# EAGLE design fpc_cable_all (EAGLE 9.6.2)
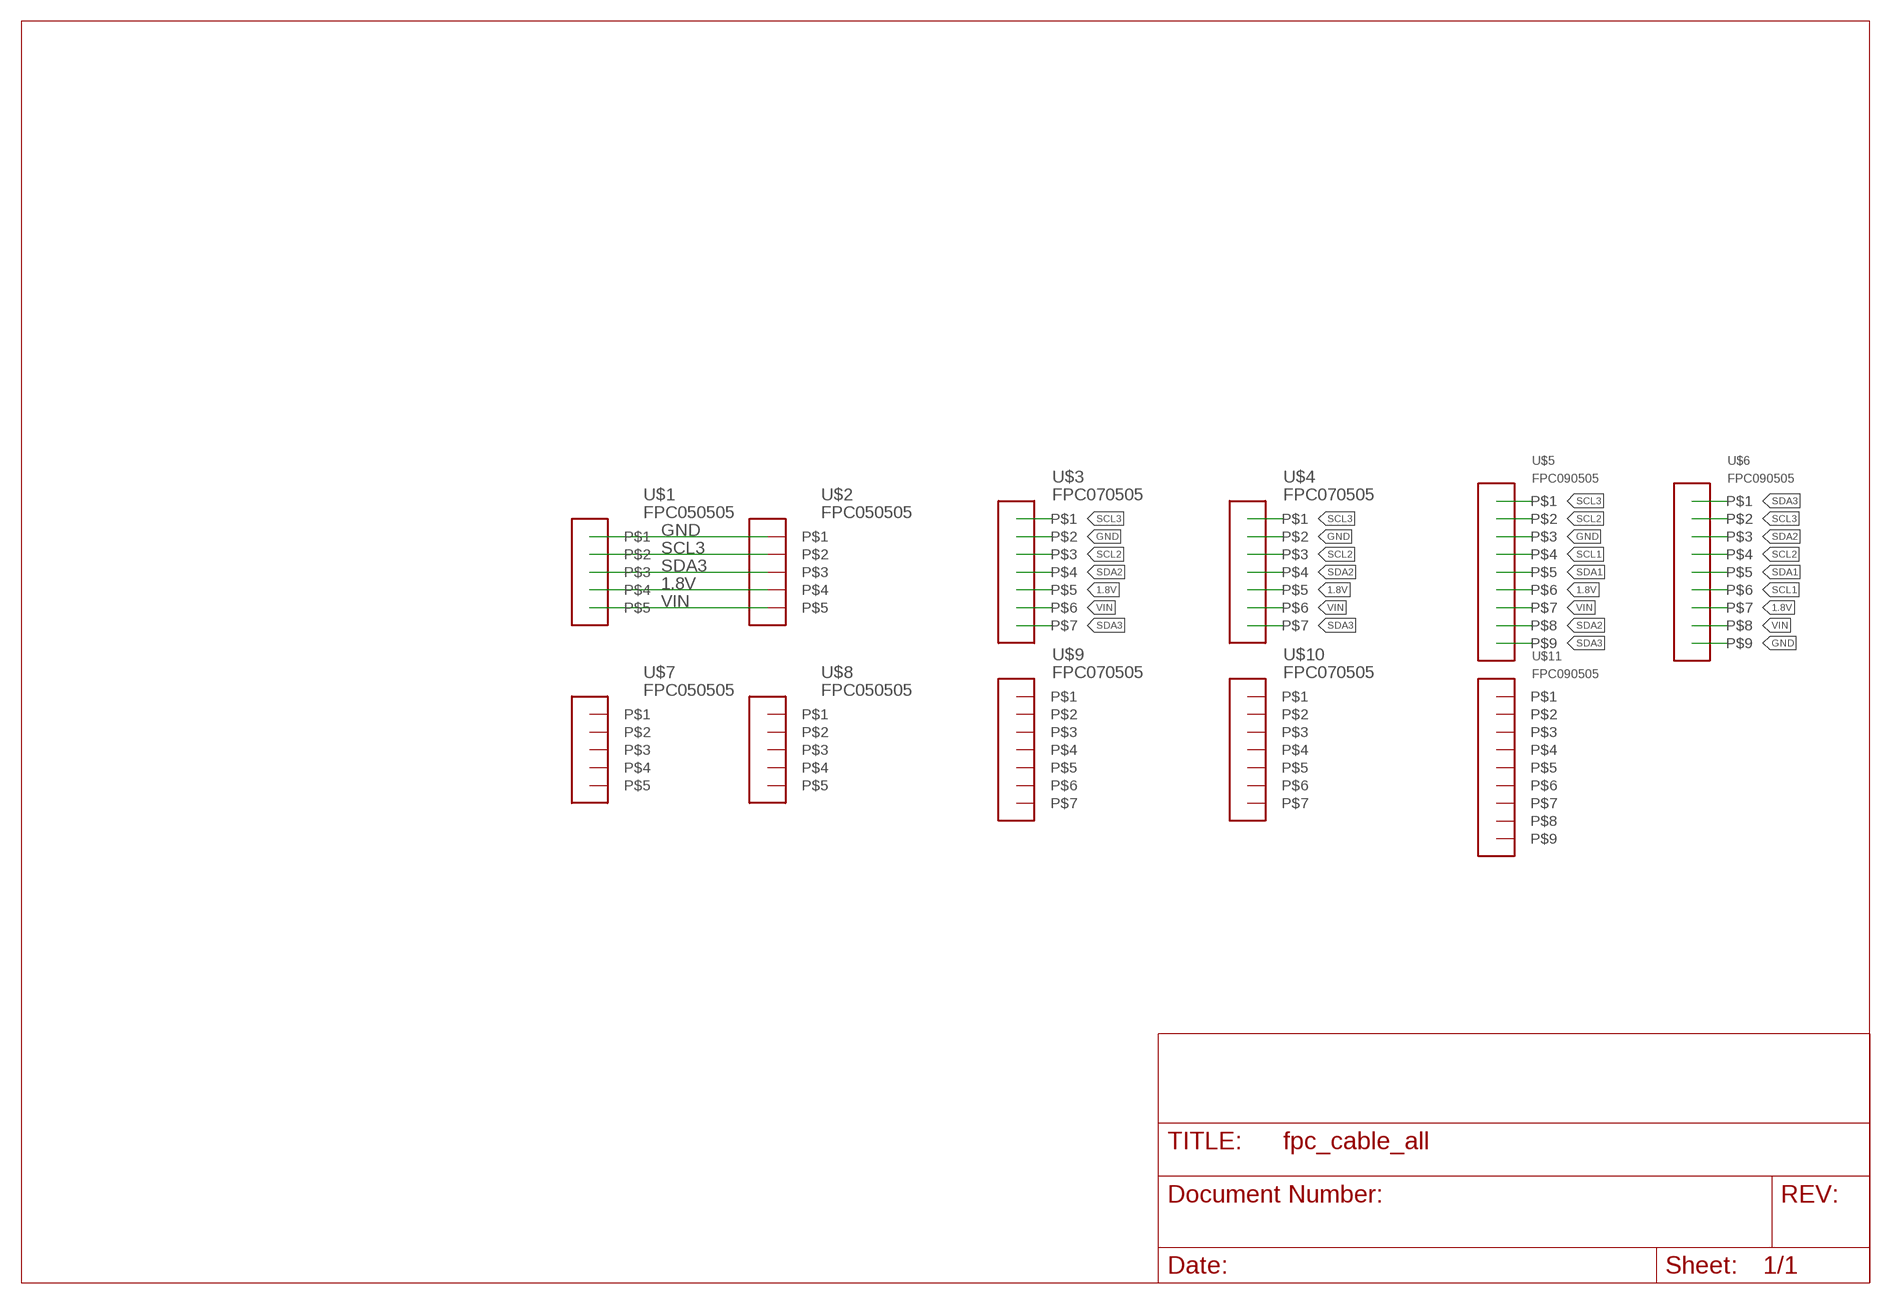
[diagram p0: schematic, sheet 1]

## Parts
U$1  FPC050505  [FPC0505]
U$2  FPC050505  [FPC0505]
U$3  FPC070505  [FPC0705]
U$4  FPC070505  [FPC0705]
U$5  FPC090505  [FPC0905]
U$6  FPC090505  [FPC0905]
U$7  FPC050505  [FPC0505]
U$8  FPC050505  [FPC0505]
U$9  FPC070505  [FPC0705]
U$10  FPC070505  [FPC0705]
U$11  FPC090505  [FPC0905]

## Nets
1.8V: U$1.P$4 U$2.P$4 U$3.P$5 U$4.P$5 U$5.P$6 U$6.P$7
GND: U$1.P$1 U$2.P$1 U$3.P$2 U$4.P$2 U$5.P$3 U$6.P$9
SCL1: U$5.P$4 U$6.P$6
SCL2: U$3.P$3 U$4.P$3 U$5.P$2 U$6.P$4
SCL3: U$1.P$2 U$2.P$2 U$3.P$1 U$4.P$1 U$5.P$1 U$6.P$2
SDA1: U$5.P$5 U$6.P$5
SDA2: U$3.P$4 U$4.P$4 U$5.P$8 U$6.P$3
SDA3: U$1.P$3 U$2.P$3 U$3.P$7 U$4.P$7 U$5.P$9 U$6.P$1
VIN: U$1.P$5 U$2.P$5 U$3.P$6 U$4.P$6 U$5.P$7 U$6.P$8
Unconnected: U$7.P$1 U$7.P$2 U$7.P$3 U$7.P$4 U$7.P$5 U$8.P$1 U$8.P$2 U$8.P$3 U$8.P$4 U$8.P$5 U$9.P$1 U$9.P$2 U$9.P$3 U$9.P$4 U$9.P$5 U$9.P$6 U$9.P$7 U$10.P$1 U$10.P$2 U$10.P$3 U$10.P$4 U$10.P$5 U$10.P$6 U$10.P$7 U$11.P$1 U$11.P$2 U$11.P$3 U$11.P$4 U$11.P$5 U$11.P$6 U$11.P$7 U$11.P$8 U$11.P$9

## Library data of the parts
U$1 U$2 U$7 U$8 = my_library:FPC0505
U$3 U$4 U$9 U$10 = my_library:FPC0705
U$5 U$6 U$11 = my_library:FPC0905

## Board
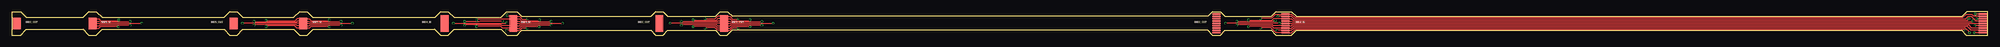
[diagram p1: board, top side]
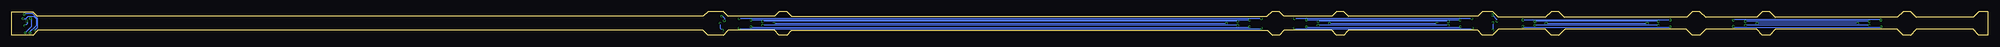
[diagram p2: board, bottom side, seen from below]

Size 422.3 x 5 mm. Coordinates in mm from the lower left corner, seen from the top.
Outline: 417.7,0 422.3,0 422.3,5 417.8,5 416.8,4 274.5,4 273.5,5 270.2,5 269.2,4 259.3,4 258.3,5 256.6,5 255.6,4 154,4 153,5 151.4,5 150.4,4 140.2,4 139.2,5 137.6,5 136.6,4 109,4 108,5 105.8,5 104.6,3.8 94.5,3.8 93.3,5 91.7,5 90.5,3.8 64.3,3.8 63.1,5 61.5,5 60.3,3.8 49.4,3.8 48.2,5 46.6,5 45.4,3.8 19.3,3.8 18.1,5 16.5,5 15.3,3.8 3.1,3.8 1.9,5 0,5 0,0 1.9,0 3.1,1.2 15.3,1.2 16.5,0 18.1,0 19.3,1.2 45.4,1.2 46.6,0 48.2,0 49.4,1.2 60.3,1.2 61.5,0 63.1,0 64.4,1.3 90.4,1.3 91.7,0 93.3,0 94.6,1.3 104.6,1.3 105.9,0 108,0 109,1 136.6,1 137.6,0 139.2,0 140.2,1 150.4,1 151.4,0 152.9,0 153.9,1 255.6,1 256.6,0 258.3,0 259.3,1 269.2,1 270.2,0 273.5,0 274.5,1 416.7,1 417.7,0
Copper layers (1*16): Top 0.035mm / dielectric 1.6mm / Bottom 0.035mm
Design rules "jlcpcb-2layers *": minimum track width 5mil, minimum drill 0.3mm, track to track 5mil, track to pad 5mil, pad to pad 5mil, via to via 5mil, smd to smd 5mil, copper to edge 0.2mm, drill to drill 6mil, minimum pad ring 10mil, minimum via ring 3mil, stop-mask expansion 4mil, vias tented up to drill 12mil, thermal gap 10mil

### Footprints (pad centres in the part's own frame; a part is rotated, then mirrored left to right if it is on the bottom)
FPC0505 = smd 0.3 x 1.7: P$1 -1,0.1; P$2 -0.5,0.1; P$3 0,0.1; P$4 0.5,0.1; P$5 1,0.1
FPC0705 = smd 0.3 x 1.7: P$1 -1.5,0; P$2 -1,0; P$3 -0.5,0; P$4 0,0; P$5 0.5,0; P$6 1,0; P$7 1.5,0
FPC0905 = smd 0.3 x 1.7: P$1 -2,0; P$2 -1.5,0; P$3 -1,0; P$4 -0.5,0; P$5 0,0; P$6 0.5,0; P$7 1,0; P$8 1.5,0; P$9 2,0

### Placement (x,y rotation side)
IMU6_OUT  FPC050505  [FPC0505]  1.2,2.5 90 top
U$1  17.2,2.5 270 top
U$2  62.2,2.5 270 top
U$3  152.2,2.5 270 top
U$4  107.2,2.5 270 top
U$5  272.2,2.5 270 top
U$6  421.2,2.5 270 top
U$8  47.5,2.5 90 top
U$9  92.5,2.5 90 top
U$10  138.4,2.5 90 top
U$11  257.5,2.5 90 top

### Tracks (layer width: path | path; a pad name or v marks a point on that pad's centre or on a via)
1.8V  (via drill 0.3)
  Top 0.127: U$1.P$4 18.7,2 18.9,2.2 25.18,2.2 v25.3,2.08 | v51.8,2.08 51.96,2.25 60.75,2.25 61,2 U$2.P$4 63.6,2 63.8,2.2 70.28,2.2 v70.4,2.08 | v96.8,2.08 96.97,2.25 104.55,2.25 104.81,1.98 107.2,1.98 U$4.P$5 108.5,2 108.7,2.2 115.18,2.2 v115.3,2.08 | v143.1,2.08 143.22,2.2 150.7,2.2 150.9,2 U$3.P$5 153.5,2 153.7,2.2 160.18,2.2 v160.3,2.08 | v261.8,2.08 261.92,2.2 269.4,2.2 269.6,2 U$5.P$6 273.5,2 273.7,2.2 418.2,2.2 418.9,1.5 U$6.P$7
  Bottom 0.127: v25.3,2.08 v51.8,2.08 | v70.4,2.08 v96.8,2.08 | v115.3,2.08 v143.1,2.08 | v160.3,2.08 v261.8,2.08
GND  (via drill 0.3)
  Top 0.127: U$1.P$1 18.6,3.5 19,3.1 22.76,3.1 v22.88,3.22 | v54.36,3.17 54.53,3.01 60.51,3.01 61,3.5 U$2.P$1 63.6,3.5 64.05,3.05 67.72,3.05 v67.88,3.22 | v99.32,3.22 99.6,3.5 U$4.P$2 108.5,3.5 108.9,3.1 112.66,3.1 v112.78,3.22 | v145.62,3.22 145.74,3.1 150.5,3.1 150.9,3.5 U$3.P$2 153.5,3.5 153.9,3.1 157.66,3.1 v157.78,3.22 | v264.32,3.22 264.44,3.1 269.2,3.1 269.6,3.5 U$5.P$3 273.5,3.5 273.9,3.1 417.9,3.1 v418.29,3.49 | U$6.P$9 v419.4,0.5
  Bottom 0.127: v54.36,3.17 54.2,3.33 22.99,3.33 v22.88,3.22 | v67.88,3.22 68,3.33 99.2,3.33 v99.32,3.22 | v112.78,3.22 112.89,3.33 145.5,3.33 v145.62,3.22 | v264.32,3.22 264.2,3.33 157.89,3.33 v157.78,3.22 | v418.29,3.49 418.1,3.3 418.1,1.8 v419.4,0.5
SCL1  (via drill 0.3)
  Top 0.127: U$5.P$4 273.5,3 273.7,2.8 418.89,2.8 v419.11,3.02 | U$6.P$6 419.52,2 v419.5,1.98
  Bottom 0.127: v419.5,1.98 419.01,2.48 419.01,2.92 v419.11,3.02
SCL2  (via drill 0.3)
  Top 0.127: U$4.P$3 108.5,3 108.7,2.8 115.18,2.8 v115.3,2.92 | v270.6,4 U$5.P$2 273.5,4 274.1,3.4 417.5,3.4 418.02,3.92 418.88,3.92 419.8,3 U$6.P$4 | v270,3.08 269.79,3.08 269.51,2.8 261.92,2.8 v261.8,2.92 | v143.1,2.92 143.22,2.8 150.7,2.8 150.9,3 U$3.P$3 153.5,3 153.7,2.8 160.18,2.8 v160.3,2.92
  Bottom 0.127: v270.6,4 270.4,4 270,3.6 v270,3.08 | v115.3,2.92 v143.1,2.92 | v160.3,2.92 v261.8,2.92
SCL3  (via drill 0.3)
  Top 0.127: U$1.P$2 18.7,3 18.9,2.8 25.18,2.8 v25.3,2.92 | v105.9,4.3 105.9,4.2 106.1,4 U$4.P$1 108.5,4 109.1,3.4 110.14,3.4 v110.27,3.53 | v104.88,3 100.08,3 99.89,2.8 96.92,2.8 v96.8,2.92 | 270.1,4.5 U$5.P$1 273.5,4.5 274.3,3.7 416.87,3.7 417.57,4.4 418.95,4.4 419.35,4 U$6.P$2 | v51.8,2.92 51.96,2.75 60.75,2.75 61,3 U$2.P$2 63.6,3 63.8,2.8 70.28,2.8 v70.4,2.92 | v148.14,3.52 148.3,3.35 150.25,3.35 150.9,4 U$3.P$1 153.5,4 154.1,3.4 155.14,3.4 v155.26,3.52
  Top 0.152: v266.84,3.52 267.05,3.72 269.31,3.72 270.09,4.5 270.1,4.5
  Bottom 0.127: v105.9,4.3 104.89,3.29 v104.88,3 | v25.3,2.92 v51.8,2.92 | v70.4,2.92 v96.8,2.92 | v110.27,3.53 110.38,3.63 148.02,3.63 v148.14,3.52 | v155.26,3.52 155.38,3.64 266.72,3.64 v266.84,3.52
SDA1
  Top 0.127: U$5.P$5 U$6.P$5
SDA2  (via drill 0.3)
  Top 0.127: v270.4,1 U$5.P$8 273.5,1 274.1,1.6 417.4,1.6 418.4,0.6 v418.4,0.5 | v140.7,2.5 U$3.P$4 v162.7,2.5 | U$4.P$4 v117.7,2.5 | v270.9,2.5 v259.4,2.5 | v419.9,3.5 U$6.P$3
  Bottom 0.127: v270.9,2.5 270.9,1.5 v270.4,1 | v140.7,2.5 v117.7,2.5 | v259.4,2.5 v162.7,2.5 | v419.9,3.5 419.3,3.5 418.8,4 417.6,4 417.1,3.5 417.1,2 418.4,0.7 v418.4,0.5
SDA3  (via drill 0.3)
  Top 0.127: v105.8,1 U$4.P$7 108.5,1 109.1,1.6 110.06,1.6 v110.18,1.48 | v105.78,2.6 105.67,2.5 v94.4,2.5 | v49.3,2.5 U$2.P$3 v72.8,2.5 | U$1.P$3 v27.8,2.5 | v148.14,1.48 148.26,1.6 150.3,1.6 150.9,1 U$3.P$7 153.5,1 154.1,1.6 155.14,1.6 v155.26,1.48 | v266.84,1.48 266.96,1.6 269.1,1.6 270.2,0.5 U$5.P$9 273.5,0.5 274.3,1.3 417.12,1.3 417.5,0.92 v417.5,0.9 | U$6.P$1 419.64,4.5 v419.62,4.52
  Bottom 0.127: v105.8,1 105.77,1.03 v105.78,2.6 | v27.8,2.5 v49.3,2.5 | v94.4,2.5 v72.8,2.5 | v110.18,1.48 110.3,1.37 148.02,1.37 v148.14,1.48 | v155.26,1.48 155.38,1.36 266.72,1.36 v266.84,1.48 | v419.62,4.52 419.42,4.72 417.92,4.72 416.72,3.52 416.72,1.68 v417.5,0.9
VIN  (via drill 0.3)
  Top 0.127: U$1.P$5 18.6,1.5 19,1.9 22.66,1.9 v22.78,1.78 | v54.36,1.83 54.53,1.99 60.51,1.99 61,1.5 U$2.P$5 63.6,1.5 64,1.9 67.76,1.9 v67.88,1.78 | v99.37,1.83 99.44,1.9 104.5,1.9 104.9,1.5 U$4.P$6 108.5,1.5 108.9,1.9 112.58,1.9 v112.7,1.78 | v145.62,1.78 145.74,1.9 150.5,1.9 150.9,1.5 U$3.P$6 153.5,1.5 153.9,1.9 157.66,1.9 v157.78,1.78 | v264.32,1.78 264.44,1.9 269.3,1.9 269.7,1.5 U$5.P$7 273.5,1.5 273.9,1.9 417.9,1.9 418.8,1 U$6.P$8
  Bottom 0.127: v54.36,1.83 54.2,1.67 22.9,1.67 v22.78,1.78 | v67.88,1.78 68,1.67 99.2,1.67 v99.37,1.83 | v145.62,1.78 145.5,1.67 112.82,1.67 v112.7,1.78 | v264.32,1.78 264.2,1.67 157.89,1.67 v157.78,1.78

### Text on the board
tPlace: IMU6_OUT | IMU6_IN | IMU5_OUT | IMU5_IN | IMU4_IN | IMU4_IN | IMU3_OUT | IMU3_OUT | IMU2_OUT | IMU2_IN